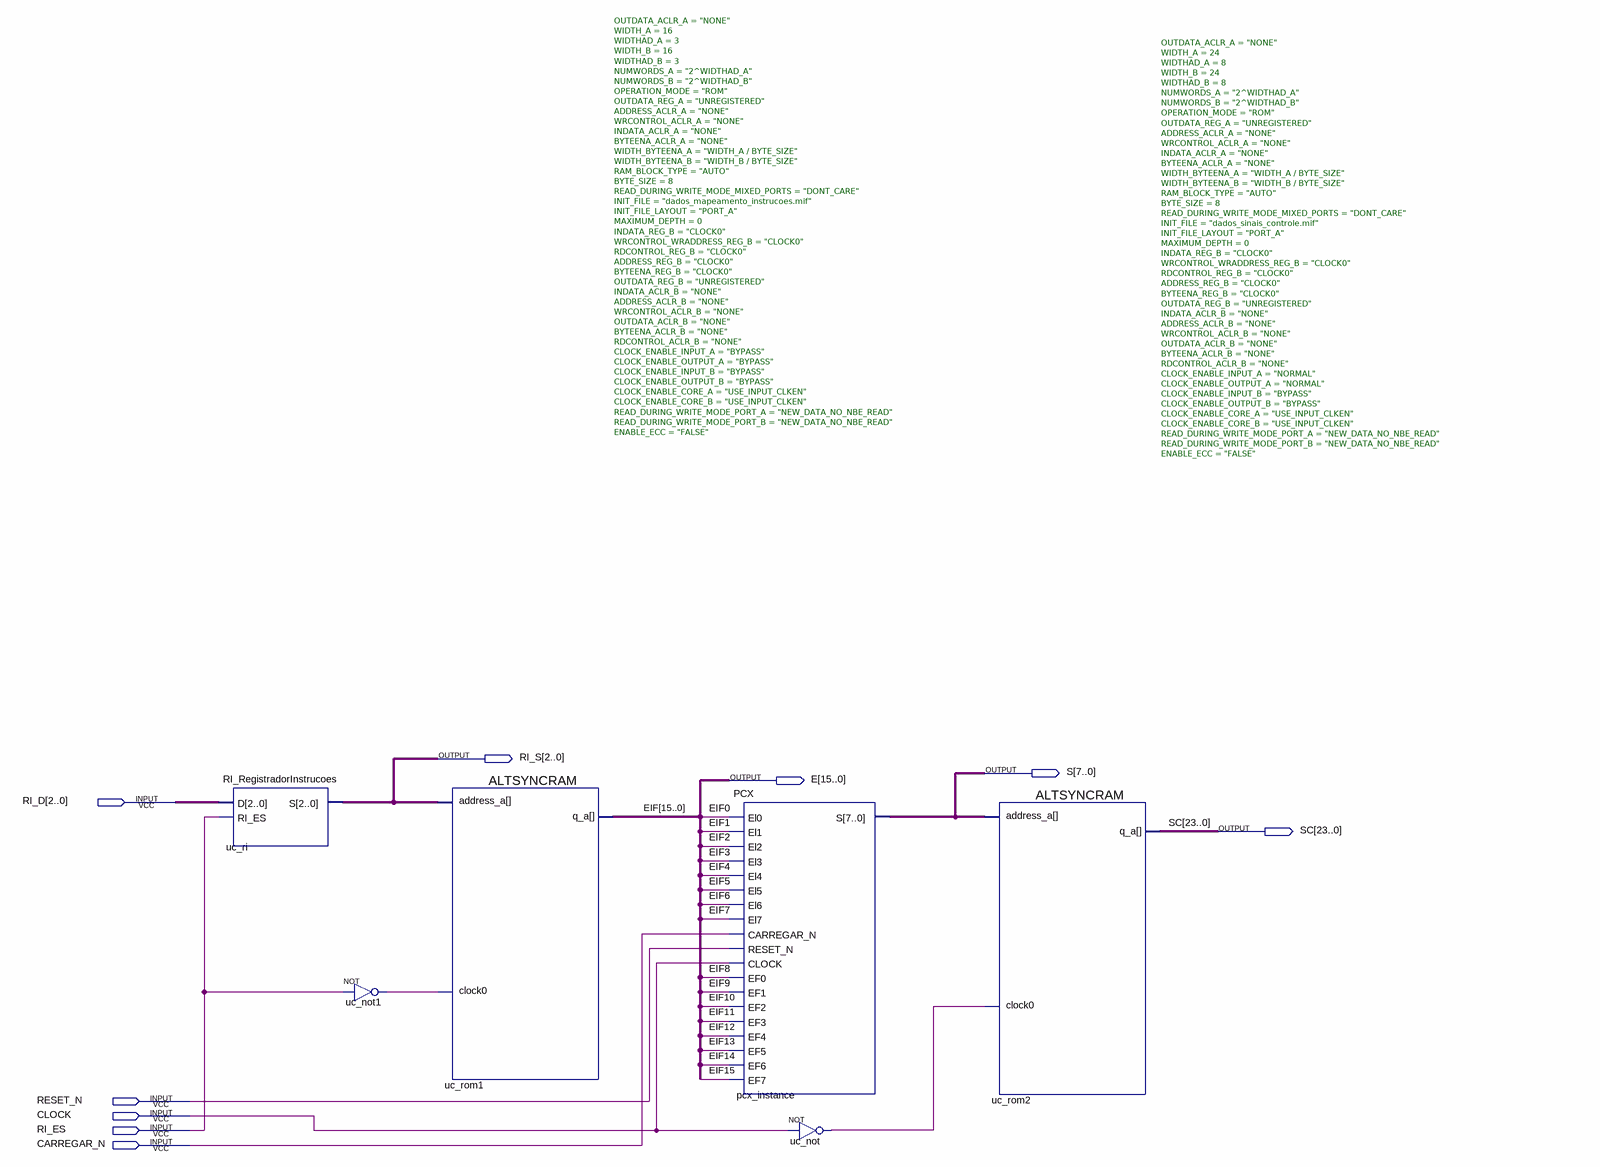
[diagram p0: schematic sheet]
// Quartus schematic UC_UnidadeDeControle.bdf as structural Verilog: 6 symbols, 9 pins
module UC_UnidadeDeControle (
  input  [2:0] RI_D,
  input  RESET_N,
  input  CLOCK,
  input  RI_ES,
  input  CARREGAR_N,
  output [2:0] RI_S,
  output [7:0] S,
  output [15:0] E,
  output [23:0] SC
);

  wire uc_not1_out, uc_not_out;

  RI_RegistradorInstrucoes uc_ri (.D(RI_D), .RI_ES(RI_ES), .S(RI_S));
  not uc_not1 (uc_not1_out, RI_ES);
  ALTSYNCRAM #(.OUTDATA_ACLR_A("NONE"), .WIDTH_A(16), .WIDTHAD_A(3), .WIDTH_B(16), .WIDTHAD_B(3), .NUMWORDS_A("2^WIDTHAD_A"), .NUMWORDS_B("2^WIDTHAD_B"), .OPERATION_MODE("ROM"), .OUTDATA_REG_A("UNREGISTERED"), .ADDRESS_ACLR_A("NONE"), .WRCONTROL_ACLR_A("NONE"), .INDATA_ACLR_A("NONE"), .BYTEENA_ACLR_A("NONE"), .WIDTH_BYTEENA_A("WIDTH_A / BYTE_SIZE"), .WIDTH_BYTEENA_B("WIDTH_B / BYTE_SIZE"), .RAM_BLOCK_TYPE("AUTO"), .BYTE_SIZE(8), .READ_DURING_WRITE_MODE_MIXED_PORTS("DONT_CARE"), .INIT_FILE("dados_mapeamento_instrucoes.mif"), .INIT_FILE_LAYOUT("PORT_A"), .MAXIMUM_DEPTH(0), .INDATA_REG_B("CLOCK0"), .WRCONTROL_WRADDRESS_REG_B("CLOCK0"), .RDCONTROL_REG_B("CLOCK0"), .ADDRESS_REG_B("CLOCK0"), .BYTEENA_REG_B("CLOCK0"), .OUTDATA_REG_B("UNREGISTERED"), .INDATA_ACLR_B("NONE"), .ADDRESS_ACLR_B("NONE"), .WRCONTROL_ACLR_B("NONE"), .OUTDATA_ACLR_B("NONE"), .BYTEENA_ACLR_B("NONE"), .RDCONTROL_ACLR_B("NONE"), .CLOCK_ENABLE_INPUT_A("BYPASS"), .CLOCK_ENABLE_OUTPUT_A("BYPASS"), .CLOCK_ENABLE_INPUT_B("BYPASS"), .CLOCK_ENABLE_OUTPUT_B("BYPASS"), .CLOCK_ENABLE_CORE_A("USE_INPUT_CLKEN"), .CLOCK_ENABLE_CORE_B("USE_INPUT_CLKEN"), .READ_DURING_WRITE_MODE_PORT_A("NEW_DATA_NO_NBE_READ"), .READ_DURING_WRITE_MODE_PORT_B("NEW_DATA_NO_NBE_READ"), .ENABLE_ECC("FALSE")) uc_rom1 (
    .address_a(RI_S), .clock0(uc_not1_out), .q_a(E));
  PCX pcx_instance (
    .El0(E[0]), .El1(E[1]), .El2(E[2]), .El3(E[3]), .El4(E[4]), .El5(E[5]), .El6(E[6]), .El7(E[7]),
    .CARREGAR_N(CARREGAR_N), .RESET_N(RESET_N), .CLOCK(CLOCK), .EF0(E[8]), .EF1(E[9]), .EF2(E[10]),
    .EF3(E[11]), .EF4(E[12]), .EF5(E[13]), .EF6(E[14]), .EF7(E[15]), .S(S));
  not uc_not (uc_not_out, CLOCK);
  ALTSYNCRAM #(.OUTDATA_ACLR_A("NONE"), .WIDTH_A(24), .WIDTHAD_A(8), .WIDTH_B(24), .WIDTHAD_B(8), .NUMWORDS_A("2^WIDTHAD_A"), .NUMWORDS_B("2^WIDTHAD_B"), .OPERATION_MODE("ROM"), .OUTDATA_REG_A("UNREGISTERED"), .ADDRESS_ACLR_A("NONE"), .WRCONTROL_ACLR_A("NONE"), .INDATA_ACLR_A("NONE"), .BYTEENA_ACLR_A("NONE"), .WIDTH_BYTEENA_A("WIDTH_A / BYTE_SIZE"), .WIDTH_BYTEENA_B("WIDTH_B / BYTE_SIZE"), .RAM_BLOCK_TYPE("AUTO"), .BYTE_SIZE(8), .READ_DURING_WRITE_MODE_MIXED_PORTS("DONT_CARE"), .INIT_FILE("dados_sinais_controle.mif"), .INIT_FILE_LAYOUT("PORT_A"), .MAXIMUM_DEPTH(0), .INDATA_REG_B("CLOCK0"), .WRCONTROL_WRADDRESS_REG_B("CLOCK0"), .RDCONTROL_REG_B("CLOCK0"), .ADDRESS_REG_B("CLOCK0"), .BYTEENA_REG_B("CLOCK0"), .OUTDATA_REG_B("UNREGISTERED"), .INDATA_ACLR_B("NONE"), .ADDRESS_ACLR_B("NONE"), .WRCONTROL_ACLR_B("NONE"), .OUTDATA_ACLR_B("NONE"), .BYTEENA_ACLR_B("NONE"), .RDCONTROL_ACLR_B("NONE"), .CLOCK_ENABLE_INPUT_A("NORMAL"), .CLOCK_ENABLE_OUTPUT_A("NORMAL"), .CLOCK_ENABLE_INPUT_B("BYPASS"), .CLOCK_ENABLE_OUTPUT_B("BYPASS"), .CLOCK_ENABLE_CORE_A("USE_INPUT_CLKEN"), .CLOCK_ENABLE_CORE_B("USE_INPUT_CLKEN"), .READ_DURING_WRITE_MODE_PORT_A("NEW_DATA_NO_NBE_READ"), .READ_DURING_WRITE_MODE_PORT_B("NEW_DATA_NO_NBE_READ"), .ENABLE_ECC("FALSE")) uc_rom2 (
    .address_a(S), .clock0(uc_not_out), .q_a(SC));

  // Other names for the same wires on the sheet: EIF[15:0] = E; EIF0 = E[0]; EIF1 = E[1]; EIF2 = E[2]; EIF3 = E[3];
  //   EIF4 = E[4]; EIF5 = E[5]; EIF6 = E[6]; EIF7 = E[7]; EIF8 = E[8]; EIF9 = E[9]; EIF10 = E[10]; EIF11 = E[11];
  //   EIF12 = E[12]; EIF13 = E[13]; EIF14 = E[14]; EIF15 = E[15]
endmodule
